# Altium schematic sheet AF AMP.SchDoc: AF AMP
size A4; Address1: UA3REO; Address2: BH8CGJ; DocumentNumber: 4; Revision: 2.0; SheetNumber: 4; SheetTotal: 18
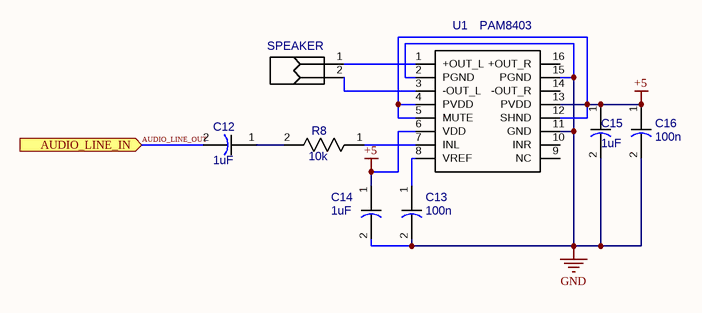
[diagram p0: AF AMP.SchDoc]

## Parts
C12  1uF  [CAP_0805]
C13  100n  [CAP_0805]
C14  1uF  [CAP_0805]
C15  1uF  [CAP_0805]
C16  100n  [CAP_0805]
R8  10k  [RES_0805]
SPEAKER  (no value)  [51022-0200]
U1  PAM8403  [PAM8403]

## Ports
AUDIO_LINE_IN (in)

## Nets
+5: C14.1 C15.1 C16.1 U1.4(PVDD) U1.5(MUTE) U1.6(VDD) U1.12(SHND) U1.13(PVDD)
GND: C13.2 C14.2 C15.2 C16.2 U1.2(PGND) U1.11(GND) U1.15(PGND)
AUDIO_LINE_OUT: C12.2 ; port AUDIO_LINE_IN
NetC12_1: C12.1 R8.2
NetC13_1: C13.1 U1.8(VREF)
NetR8_1: R8.1 U1.7(INL)
NetSPEAKER_1: SPEAKER.1 U1.1(+OUT_L)
NetSPEAKER_2: SPEAKER.2 U1.3(-OUT_L)

Not connected (* = marked no-connect by the designer): U1 9(NC) 10(INR) 14(-OUT_R) 16(+OUT_R)

## Notes on the sheet
- Title
- Size:
- Date:
- A4
- Number:
- Time:
- Revision:
- Sheet
- of
- File:

## Library data of the parts
C12-C16 = CAP_0805
  C12 C14 C15: Value: 1uF
  C13 C16: Value: 100n
R8 = RES_0805: Value: 10k
SPEAKER = 51022-0200
U1 = PAM8403: Value: PAM8403